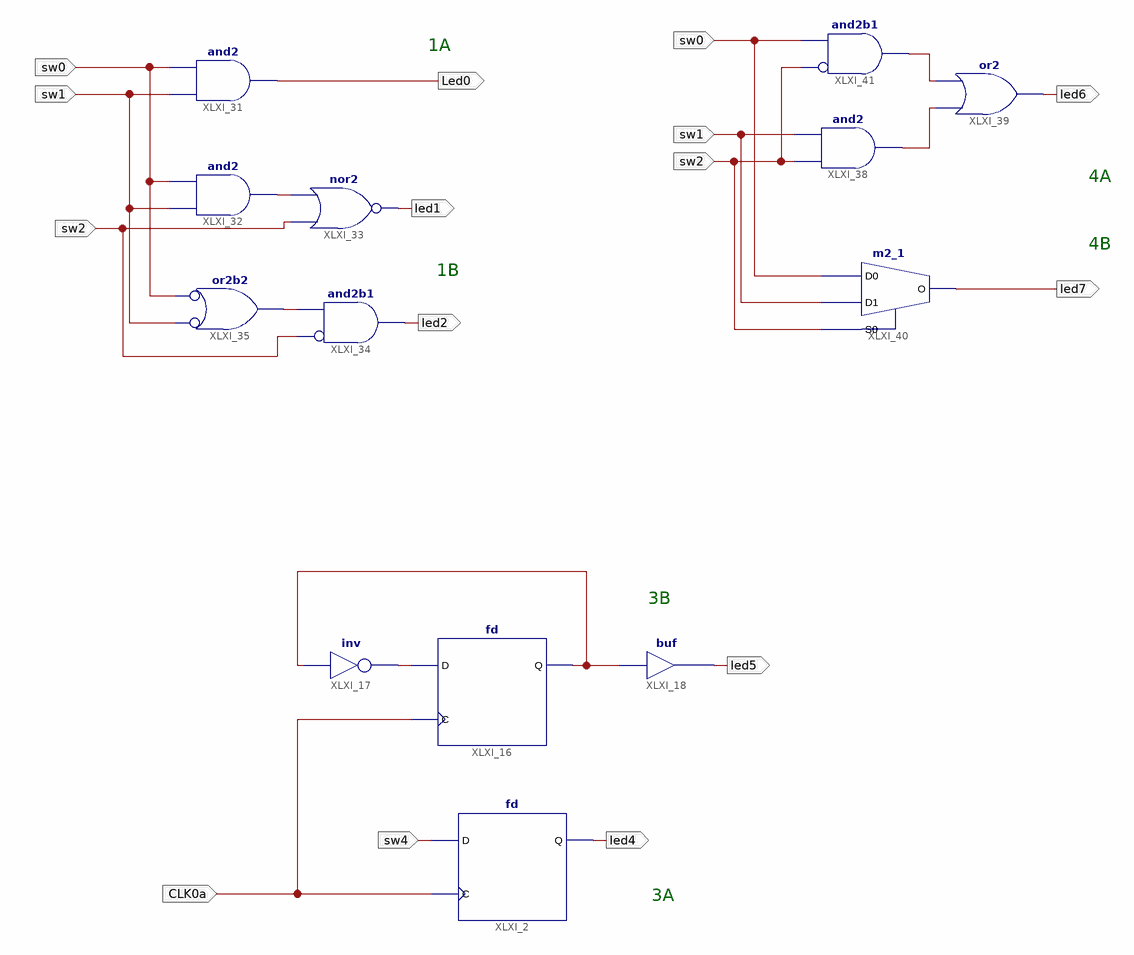
[diagram p0: schematic sheet 1]
// Xilinx ISE schematic logic_a.sch (spartan6) as structural Verilog: 13 symbols, 12 ports
module logic_a (
  input  sw2,
  input  sw0,
  input  sw1,
  input  CLK0a,
  input  sw4,
  output Led0,
  output led1,
  output led2,
  output led5,
  output led4,
  output led6,
  output led7
);

  wire XLXN_39, XLXN_42, XLXN_166, XLXN_167, XLXN_172, XLXN_175;

  and XLXI_31 (Led0, sw1, sw0);
  and XLXI_32 (XLXN_166, sw1, sw0);
  nor XLXI_33 (led1, sw2, XLXN_166);
  and XLXI_34 (led2, ~sw2, XLXN_167);  // and2b1
  or XLXI_35 (XLXN_167, ~sw1, ~sw0);  // or2b2
  fd XLXI_16 (.C(CLK0a), .D(XLXN_39), .Q(XLXN_42));
  not XLXI_17 (XLXN_39, XLXN_42);
  buf XLXI_18 (led5, XLXN_42);
  fd XLXI_2 (.C(CLK0a), .D(sw4), .Q(led4));
  or XLXI_39 (led6, XLXN_172, XLXN_175);
  m2_1 XLXI_40 (.D0(sw0), .D1(sw1), .S0(sw2), .O(led7));
  and XLXI_41 (XLXN_175, ~sw2, sw0);  // and2b1
  and XLXI_38 (XLXN_172, sw2, sw1);

  // Notes on the sheet:
  //   1A
  //   4A
  //   4B
  //   1B
  //   3B
  //   3A
endmodule
